# Altium schematic sheet Hierogram_V2.1.SchDoc
size A2
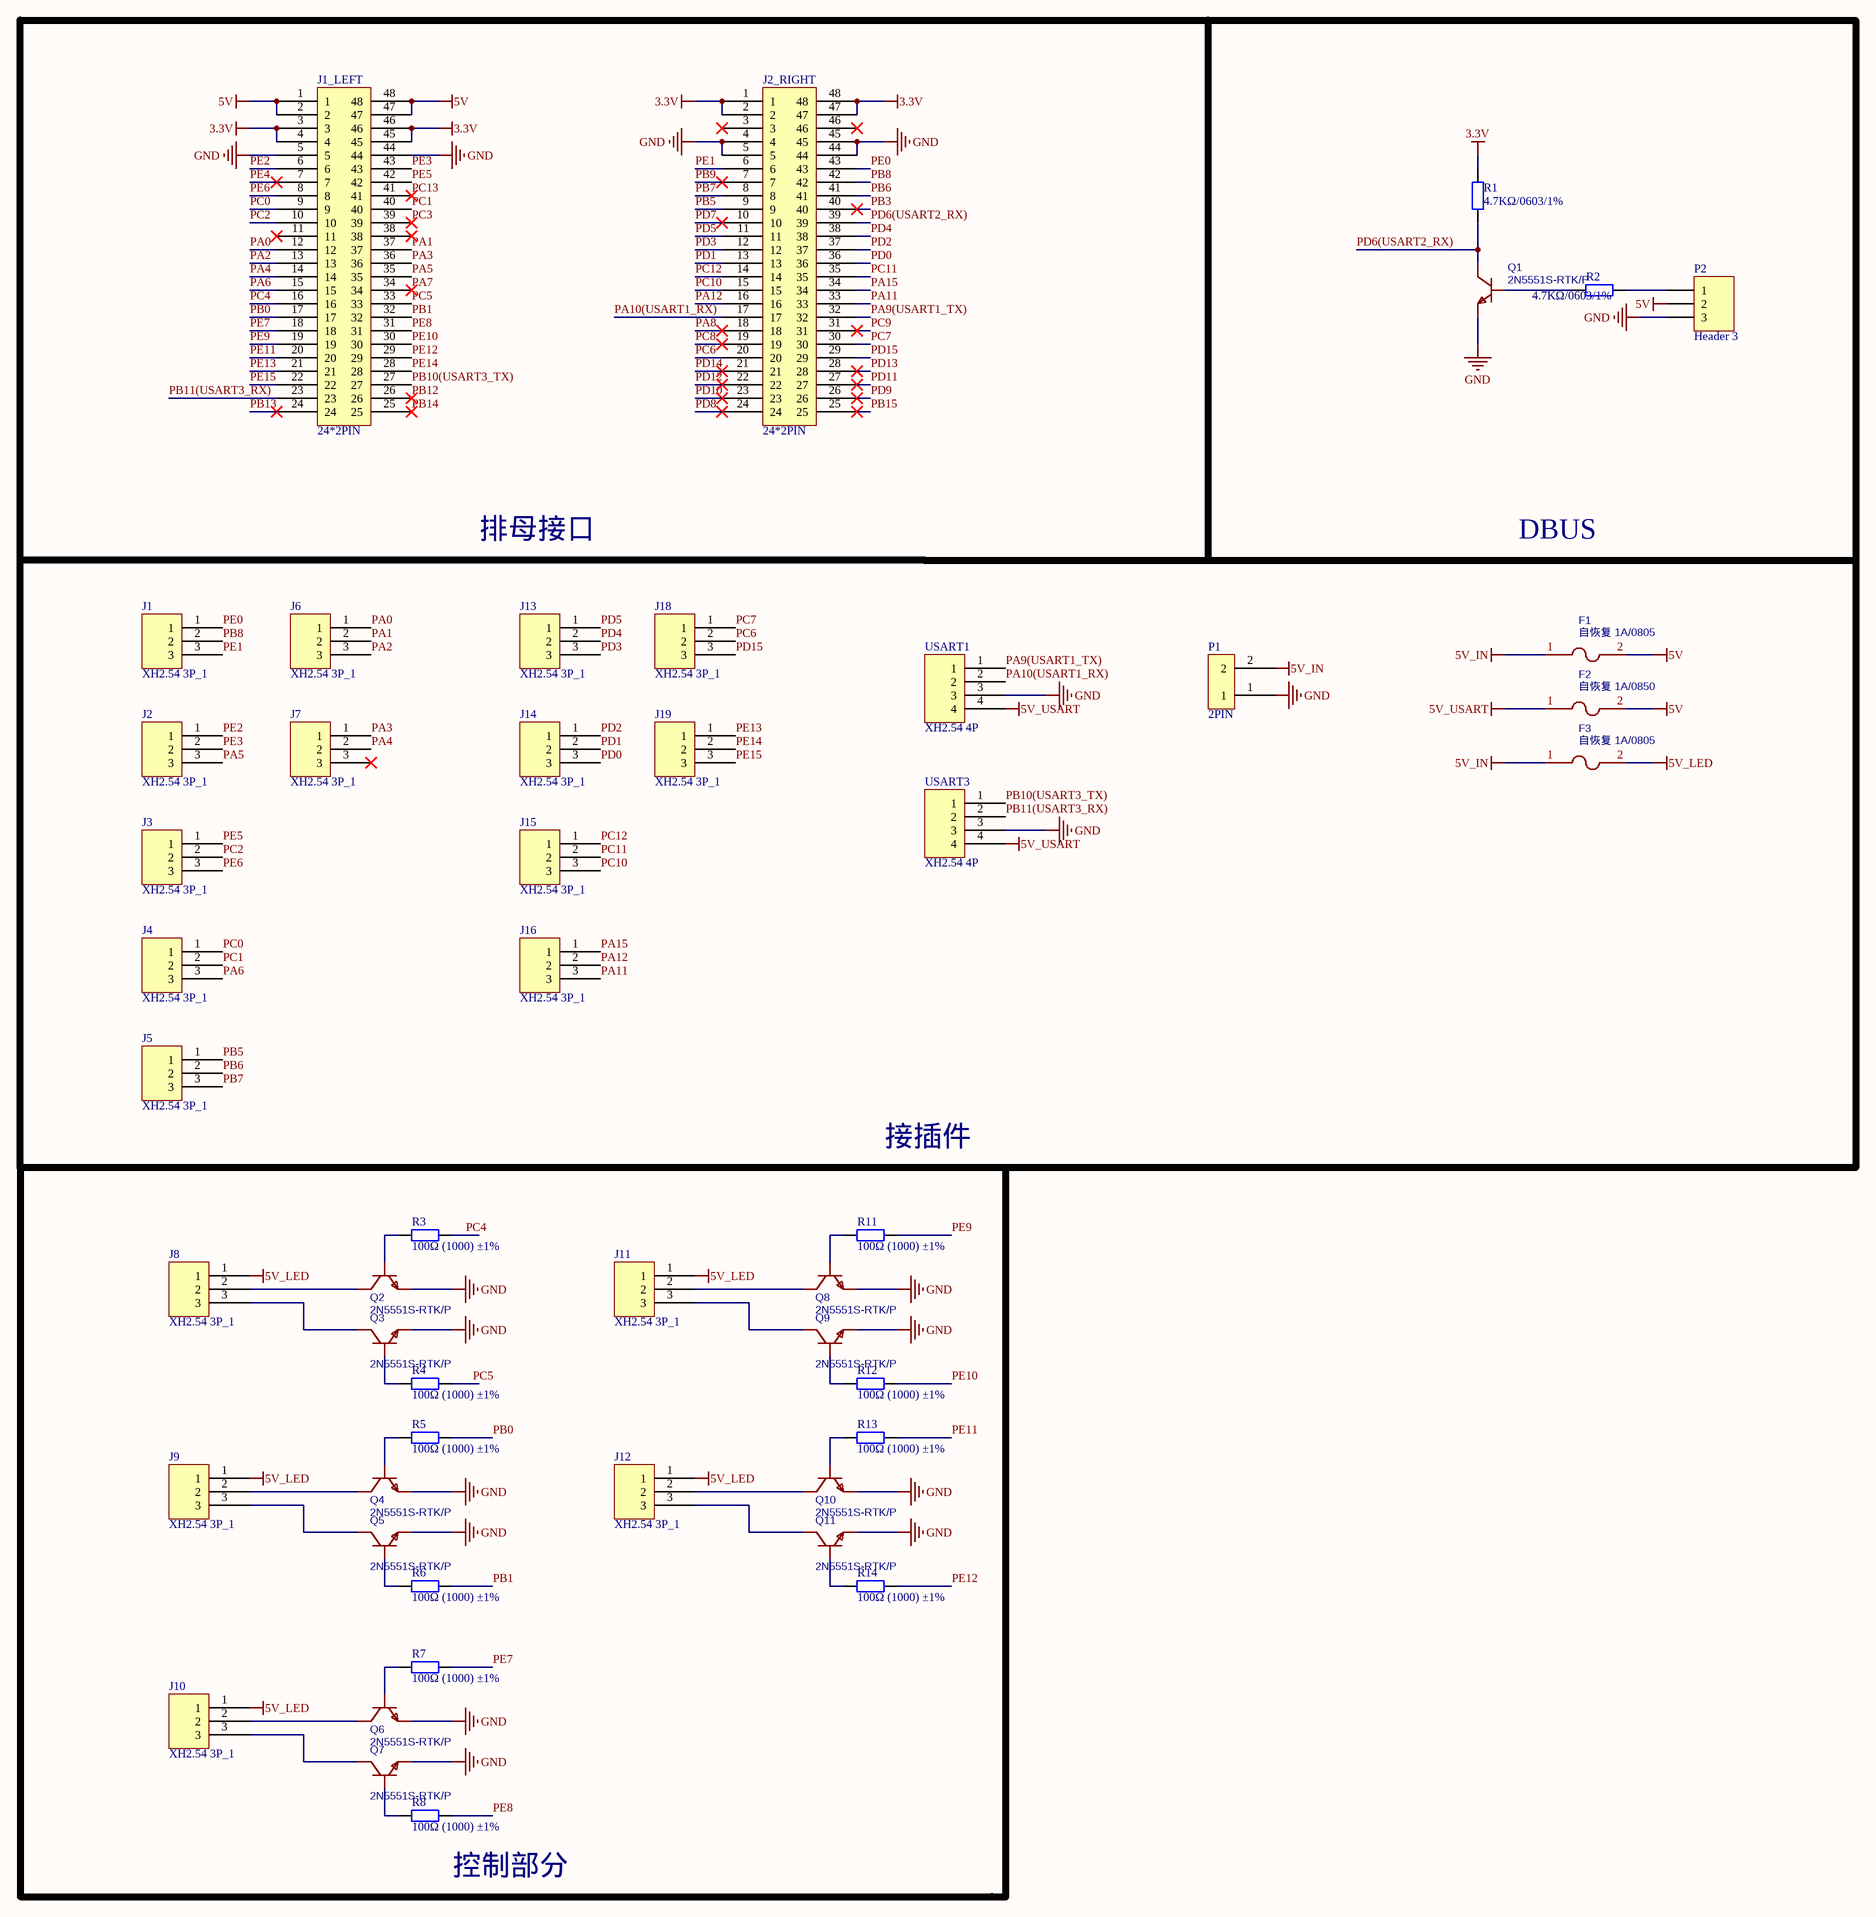
[diagram p0: Hierogram_V2.1.SchDoc]

## Parts
F1  自恢复 1A/0805  [1A 0805]
F2  自恢复 1A/0850  [1A 0805]
F3  自恢复 1A/0805  [1A 0805]
J1  XH2.54 3P_1  [XH2.54_3P立式]
J1_LEFT  24*2PIN  [24*2PIN_D]
J2  XH2.54 3P_1  [XH2.54_3P立式]
J2_RIGHT  24*2PIN  [24*2PIN_D]
J3  XH2.54 3P_1  [XH2.54_3P立式]
J4  XH2.54 3P_1  [XH2.54_3P立式]
J5  XH2.54 3P_1  [XH2.54_3P立式]
J6  XH2.54 3P_1  [XH2.54_3P立式]
J7  XH2.54 3P_1  [XH2.54_3P立式]
J8  XH2.54 3P_1  [XH2.54_3P立式]
J9  XH2.54 3P_1  [XH2.54_3P立式]
J10  XH2.54 3P_1  [XH2.54_3P立式]
J11  XH2.54 3P_1  [XH2.54_3P立式]
J12  XH2.54 3P_1  [XH2.54_3P立式]
J13  XH2.54 3P_1  [XH2.54_3P立式]
J14  XH2.54 3P_1  [XH2.54_3P立式]
J15  XH2.54 3P_1  [XH2.54_3P立式]
J16  XH2.54 3P_1  [XH2.54_3P立式]
J18  XH2.54 3P_1  [XH2.54_3P立式]
J19  XH2.54 3P_1  [XH2.54_3P立式]
P1  2PIN  [2PIN]
P2  Header 3  [HDR1X3]
Q1  2N5551S-RTK/P  [2N5551]
Q2  2N5551S-RTK/P  [2N5551]
Q3  2N5551S-RTK/P  [2N5551]
Q4  2N5551S-RTK/P  [2N5551]
Q5  2N5551S-RTK/P  [2N5551]
Q6  2N5551S-RTK/P  [2N5551]
Q7  2N5551S-RTK/P  [2N5551]
Q8  2N5551S-RTK/P  [2N5551]
Q9  2N5551S-RTK/P  [2N5551]
Q10  2N5551S-RTK/P  [2N5551]
Q11  2N5551S-RTK/P  [2N5551]
R1  4.7KΩ/0603/1%  [0603_R]
R2  4.7KΩ/0603/1%  [0603_R]
R3  100Ω (1000) ±1%  [0603_R]
R4  100Ω (1000) ±1%  [0603_R]
R5  100Ω (1000) ±1%  [0603_R]
R6  100Ω (1000) ±1%  [0603_R]
R7  100Ω (1000) ±1%  [0603_R]
R8  100Ω (1000) ±1%  [0603_R]
R11  100Ω (1000) ±1%  [0603_R]
R12  100Ω (1000) ±1%  [0603_R]
R13  100Ω (1000) ±1%  [0603_R]
R14  100Ω (1000) ±1%  [0603_R]
USART1  XH2.54 4P  [XH2.54_4P卧式(短边)]
USART3  XH2.54 4P  [XH2.54_4P卧式(短边)]

## Nets
3.3V: J1_LEFT.3 J1_LEFT.4 J1_LEFT.45 J1_LEFT.46 J2_RIGHT.1 J2_RIGHT.2 J2_RIGHT.47 J2_RIGHT.48 R1.2
5V: F1.2 F2.2 J1_LEFT.1 J1_LEFT.2 J1_LEFT.47 J1_LEFT.48 P2.2
5V_IN: F1.1 F3.1 P1.2
5V_LED: F3.2 J8.1 J9.1 J10.1 J11.1 J12.1
5V_USART: F2.1 USART1.4 USART3.4
GND: J1_LEFT.5 J1_LEFT.44 J2_RIGHT.4 J2_RIGHT.5 J2_RIGHT.44 J2_RIGHT.45 P1.1 P2.3 Q1.1(E) Q2.1(E) Q3.1(E) Q4.1(E) Q5.1(E) Q6.1(E) Q7.1(E) Q8.1(E) Q9.1(E) Q10.1(E) Q11.1(E) USART1.3 USART3.3
PA0: J1_LEFT.12 J6.1
PA1: J1_LEFT.37 J6.2
PA2: J1_LEFT.13 J6.3
PA3: J1_LEFT.36 J7.1
PA4: J1_LEFT.14 J7.2
PA5: J1_LEFT.35 J2.3
PA6: J1_LEFT.15 J4.3
PA7: J1_LEFT.34
PA8: J2_RIGHT.18
PA9(USART1_TX): J2_RIGHT.32 USART1.1
PA10(USART1_RX): J2_RIGHT.17 USART1.2
PA11: J2_RIGHT.33 J16.3
PA12: J2_RIGHT.16 J16.2
PA15: J2_RIGHT.34 J16.1
PB0: J1_LEFT.17 R5.2
PB1: J1_LEFT.32 R6.2
PB3: J2_RIGHT.40
PB5: J2_RIGHT.9 J5.1
PB6: J2_RIGHT.41 J5.2
PB7: J2_RIGHT.8 J5.3
PB8: J1.2 J2_RIGHT.42
PB9: J2_RIGHT.7
PB10(USART3_TX): J1_LEFT.27 USART3.1
PB11(USART3_RX): J1_LEFT.23 USART3.2
PB12: J1_LEFT.26
PB13: J1_LEFT.24
PB14: J1_LEFT.25
PB15: J2_RIGHT.25
PC0: J1_LEFT.9 J4.1
PC1: J1_LEFT.40 J4.2
PC2: J1_LEFT.10 J3.2
PC3: J1_LEFT.39
PC4: J1_LEFT.16 R3.2
PC5: J1_LEFT.33 R4.2
PC6: J2_RIGHT.20 J18.2
PC7: J2_RIGHT.30 J18.1
PC8: J2_RIGHT.19
PC9: J2_RIGHT.31
PC10: J2_RIGHT.15 J15.3
PC11: J2_RIGHT.35 J15.2
PC12: J2_RIGHT.14 J15.1
PC13: J1_LEFT.41
PD0: J2_RIGHT.36 J14.3
PD1: J2_RIGHT.13 J14.2
PD2: J2_RIGHT.37 J14.1
PD3: J2_RIGHT.12 J13.3
PD4: J2_RIGHT.38 J13.2
PD5: J2_RIGHT.11 J13.1
PD6(USART2_RX): J2_RIGHT.39 Q1.3(C) R1.1
PD7: J2_RIGHT.10
PD8: J2_RIGHT.24
PD9: J2_RIGHT.26
PD10: J2_RIGHT.23
PD11: J2_RIGHT.27
PD12: J2_RIGHT.22
PD13: J2_RIGHT.28
PD14: J2_RIGHT.21
PD15: J2_RIGHT.29 J18.3
PE0: J1.1 J2_RIGHT.43
PE1: J1.3 J2_RIGHT.6
PE2: J1_LEFT.6 J2.1
PE3: J1_LEFT.43 J2.2
PE4: J1_LEFT.7
PE5: J1_LEFT.42 J3.1
PE6: J1_LEFT.8 J3.3
PE7: J1_LEFT.18 R7.2
PE8: J1_LEFT.31 R8.2
PE9: J1_LEFT.19 R11.2
PE10: J1_LEFT.30 R12.2
PE11: J1_LEFT.20 R13.2
PE12: J1_LEFT.29 R14.2
PE13: J1_LEFT.21 J19.1
PE14: J1_LEFT.28 J19.2
PE15: J1_LEFT.22 J19.3
NetJ8_2: J8.2 Q2.3(C)
NetJ8_3: J8.3 Q3.3(C)
NetJ9_2: J9.2 Q4.3(C)
NetJ9_3: J9.3 Q5.3(C)
NetJ10_2: J10.2 Q6.3(C)
NetJ10_3: J10.3 Q7.3(C)
NetJ11_2: J11.2 Q8.3(C)
NetJ11_3: J11.3 Q9.3(C)
NetJ12_2: J12.2 Q10.3(C)
NetJ12_3: J12.3 Q11.3(C)
NetP2_1: P2.1 R2.2
NetQ1_2: Q1.2(B) R2.1
NetQ2_2: Q2.2(B) R3.1
NetQ3_2: Q3.2(B) R4.1
NetQ4_2: Q4.2(B) R5.1
NetQ5_2: Q5.2(B) R6.1
NetQ6_2: Q6.2(B) R7.1
NetQ7_2: Q7.2(B) R8.1
NetQ8_2: Q8.2(B) R11.1
NetQ9_2: Q9.2(B) R12.1
NetQ10_2: Q10.2(B) R13.1
NetQ11_2: Q11.2(B) R14.1

Not connected (* = marked no-connect by the designer): J1_LEFT 11* 38*; J2_RIGHT 3* 46*; J7 3*

## Notes on the sheet
- 排母接口
- DBUS
- 接插件
- (near R8) 控制部分

## Library data of the parts
F1-F3 = ASMD1206-100: BOM_Manufacturer: JDTFUSE; Contributor: LCSC; BOM_Supplier: LCSC; BOM_Manufacturer Part: ASMD1206-100; BOM_Supplier Part: C135340; spicePre: F; spiceSymbolName: ASMD1206-100
J1-J16 J18 J19 = XH2.54 3P_1: 立式
J1_LEFT J2_RIGHT = 24*2PIN_D
P2 = Header 3: Header, 3-Pin; LatestRevisionDate: 17-Jul-2002; LatestRevisionNote: Re-released for DXP Platform.; Publisher: Altium Limited
Q1-Q11 = 2N5551S-RTK/P: BOM_Manufacturer: KEC; Contributor: LCSC; SMT Type: Extend; BOM_Supplier: LCSC; BOM_Manufacturer Part: 2N5551S-RTK/P; BOM_Supplier Part: C112669; BOM_LCSC Assembly: Yes; spicePre: Q; spiceSymbolName: 2N5551S-RTK/P
R1 R2 = 0603 4.7KΩ (4701) 1%: 贴片电阻; ComponentLink1Description: 供应商链接; ComponentLink1URL: http://www.szlcsc.com/product/details_23889.html; Package: 0603; Supplier: LC; SuppliersPartNumber: C23162
R3-R8 R11-R14 = 0603 100Ω (1000) 1%: 贴片电阻; ComponentLink1Description: 供应商链接; ComponentLink1URL: http://www.szlcsc.com/product/details_23502.html; Package: 0603; Supplier: LC; SuppliersPartNumber: C22775
USART1 USART3 = XH2.54 4P: 卧式短边